# Altium schematic sheet ESP_SCH_debug and testing.SchDoc
size A4
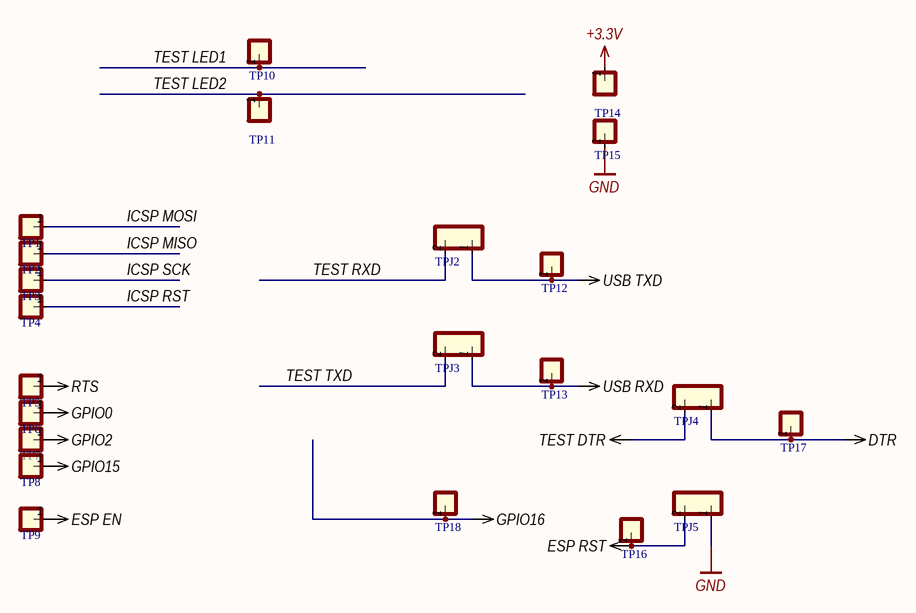
[diagram p0: ESP_SCH_debug and testing.SchDoc]

## Parts
TP1  TP  [TP no hole]  (value not drawn)
TP2  TP  [TP no hole]  (value not drawn)
TP3  TP  [TP no hole]  (value not drawn)
TP4  TP  [TP no hole]  (value not drawn)
TP5  TP  [TP no hole]  (value not drawn)
TP6  TP  [TP no hole]  (value not drawn)
TP7  TP  [TP no hole]  (value not drawn)
TP8  TP  [TP no hole]  (value not drawn)
TP9  TP  [TP no hole]  (value not drawn)
TP10  TP  [TP no hole]  (value not drawn)
TP11  TP  [TP no hole]  (value not drawn)
TP12  TP  [TP no hole]  (value not drawn)
TP13  TP  [TP no hole]  (value not drawn)
TP14  TP  [TP no hole]  (value not drawn)
TP15  TP  [TP no hole]  (value not drawn)
TP16  TP  [TP no hole]  (value not drawn)
TP17  TP  [TP no hole]  (value not drawn)
TP18  TP  [TP no hole]  (value not drawn)
TPJ2  Jumper2  [SJ_2S-NO]  (value not drawn)
TPJ3  Jumper2  [SJ_2S-NO]  (value not drawn)
TPJ4  Jumper2  [SJ_2S-NO]  (value not drawn)
TPJ5  Jumper2  [SJ_2S-NO]  (value not drawn)

## Nets
+3.3V: TP14.1(PD3)
DTR: TP17.1(PD3) TPJ4.1(PD3)
ESP EN: TP9.1(PD3)
ESP RST: TP16.1(PD3) TPJ5.2(PD4)
GND: TP15.1(PD3) TPJ5.1(PD3)
GPIO0: TP6.1(PD3)
GPIO2: TP7.1(PD3)
GPIO15: TP8.1(PD3)
GPIO16: TP18.1(PD3)
RTS: TP5.1(PD3)
TEST DTR: TPJ4.2(PD4)
USB RXD: TP13.1(PD3) TPJ3.1(PD3)
USB TXD: TP12.1(PD3) TPJ2.1(PD3)
ICSP MISO: TP2.1(PD3)
ICSP MOSI: TP1.1(PD3)
ICSP RST: TP4.1(PD3)
ICSP SCK: TP3.1(PD3)
TEST LED1: TP10.1(PD3)
TEST LED2: TP11.1(PD3)
TEST RXD: TPJ2.2(PD4)
TEST TXD: TPJ3.2(PD4)